# Altium schematic sheet 1.WIZ750SR_W7500P.SchDoc
size A4; DrawnBy: Peter; Organization: WIZnet Co., Ltd.; Address1: 5F, Humax Village; Address2: Hwangseaul-ro, Bundang-Gu; Address3: Seongnam-Si, Gyeonggi-Do; Address4: South Korea; Team: Wiki
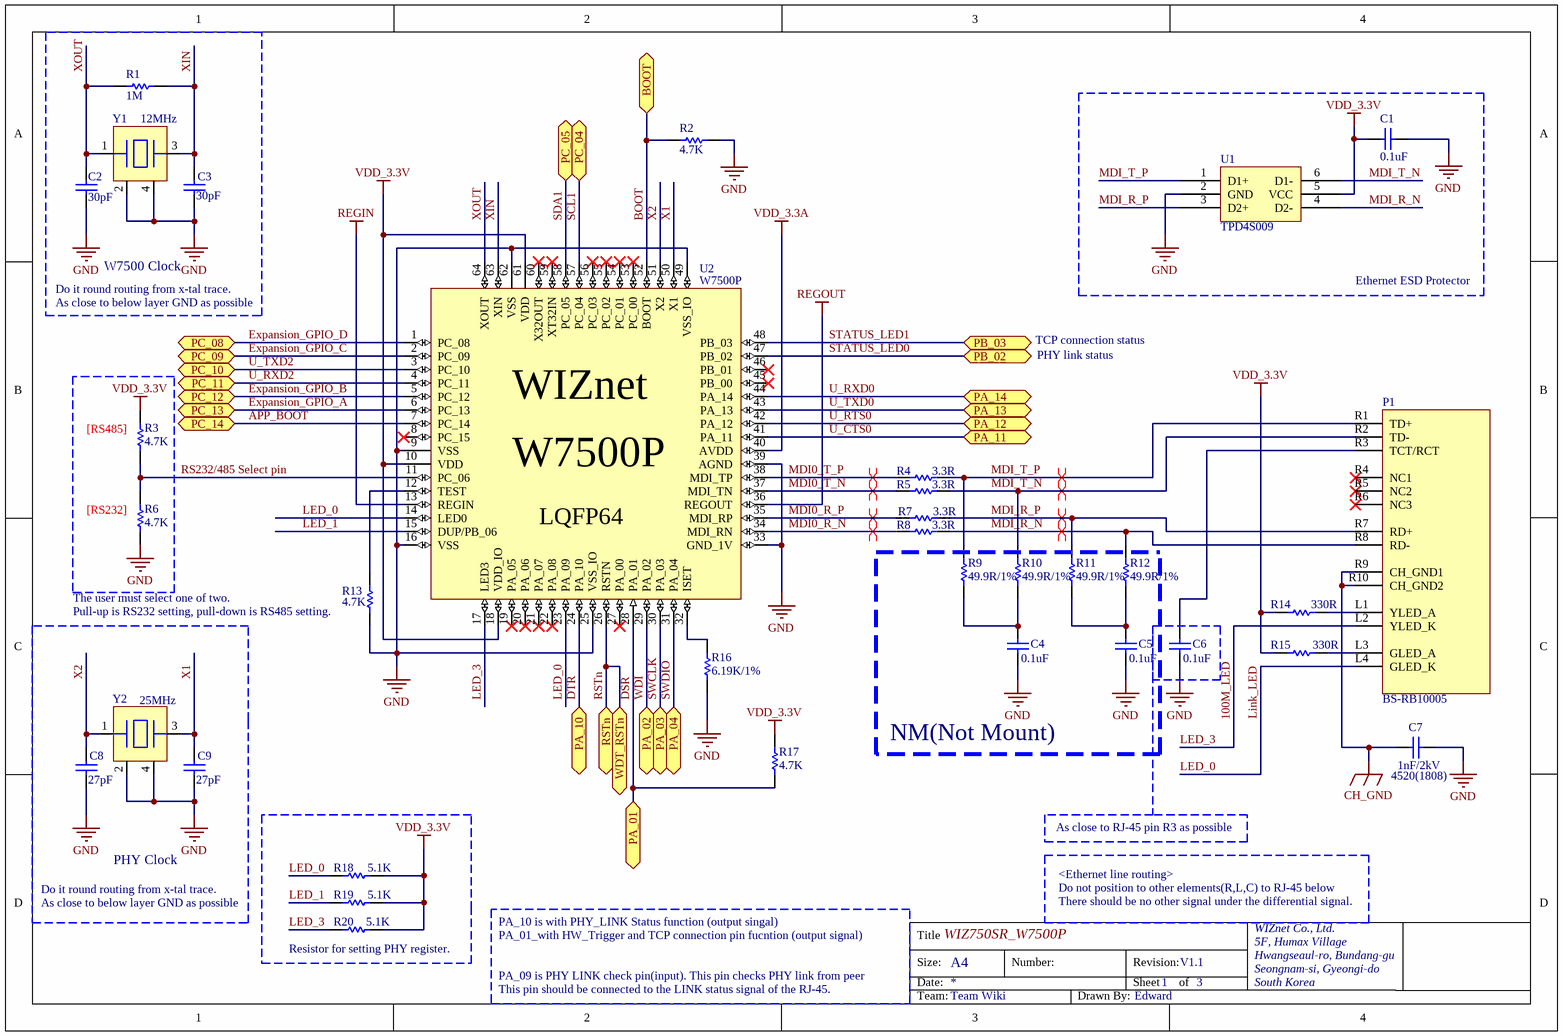
[diagram p0: 1.WIZ750SR_W7500P.SchDoc]

## Parts
C1  0.1uF  [CAP-0402]
C2  30pF  [CAP-0402]
C3  30pF  [CAP-0402]
C4  0.1uF  [CAP-0402]
C5  0.1uF  [CAP-0402]
C6  0.1uF  [CAP-0402]
C7  1nF/2kV  [CAP-1808]
C8  27pF  [CAP-0402]
C9  27pF  [CAP-0402]
P1  BS-RB10005  [RJ45-125BAG1A]
R1  1M  [RES-0402]
R2  4.7K  [RES-0402]
R3  4.7K  [RES-0402]
R4  3.3R  [RES-0402]
R5  3.3R  [RES-0402]
R6  4.7K  [RES-0402]
R7  3.3R  [RES-0402]
R8  3.3R  [RES-0402]
R9  49.9R/1%  [RES-0402]
R10  49.9R/1%  [RES-0402]
R11  49.9R/1%  [RES-0402]
R12  49.9R/1%  [RES-0402]
R13  4.7K  [RES-0402]
R14  330R  [RES-0402]
R15  330R  [RES-0402]
R16  6.19K/1%  [RES-0402]
R17  4.7K  [RES-0402]
R18  5.1K  [RES-0402]
R19  5.1K  [RES-0402]
R20  5.1K  [RES-0402]
U1  TPD4S009  [SOT-23-6L]
U2  W7500P  [W7500-LQFP64]
Y1  12MHz  [OSC-TZ1067B]
Y2  25MHz  [OSC-82J0626]

## Blocks framed on the sheet
W7500 Clock: C2 C3 R1 Y1
Ethernet ESD Protector: C1 U1
PHY Clock: C8 C9 Y2

## Ports
BOOT, PA_01, PA_02, PA_03, PA_04, PA_10, PA_11, PA_12, PA_13, PA_14, PB_02, PB_03, PC_04, PC_05, PC_08, PC_09, PC_10, PC_11, PC_12, PC_13, PC_14, RSTn, WDT_RSTn

## Nets
CH_GND: C7.2 P1.R9(CH_GND1) P1.R10(CH_GND2)
GND: C1.1 C2.1 C3.1 C4.1 C5.1 C6.1 C7.1 C8.1 C9.1 R2.1 R6.1 R13.1 R16.1 U1.2(GND) U2.9(VSS) U2.16(VSS) U2.25(VSS_IO) U2.33(GND_1V) U2.39(AGND) U2.49(VSS_IO) U2.62(VSS) Y1.2 Y1.4 Y2.2 Y2.4
REGIN: U2.13(REGIN)
REGOUT: U2.36(REGOUT)
VDD_3.3A: U2.40(AVDD)
VDD_3.3V: C1.2 R3.2 R14.1 R15.1 R17.1 R18.2 R19.2 R20.2 U1.5(VCC) U2.10(VDD) U2.18(VDD_IO) U2.61(VDD)
100M_LED: P1.L2(YLED_K) R20.1 U2.17(LED3)  [also labelled LED_3]
APP_BOOT: U2.7(PC_14) ; port PC_14
BOOT: R2.2 U2.52(BOOT) ; port BOOT
DSR: R17.2 U2.28(PA_01) ; port PA_01
DTR: U2.24(PA_10) ; port PA_10
Expansion_GPIO_A: U2.6(PC_13) ; port PC_13
Expansion_GPIO_B: U2.5(PC_12) ; port PC_12
Expansion_GPIO_C: U2.2(PC_09) ; port PC_09
Expansion_GPIO_D: U2.1(PC_08) ; port PC_08
LED_0: P1.L4(GLED_K) R18.1 U2.14(LED0) U2.23(PA_09)  [also labelled Link_LED]
LED_1: R19.1 U2.15(DUP/PB_06)
MDI0_R_N: R8.1 U2.34(MDI_RN)
MDI0_R_P: R7.1 U2.35(MDI_RP)
MDI0_T_N: R5.1 U2.37(MDI_TN)
MDI0_T_P: R4.1 U2.38(MDI_TP)
MDI_R_N: P1.R8(RD-) R8.2 R12.2 U1.4(D2-)
MDI_R_P: P1.R7(RD+) R7.2 R11.2 U1.3(D2+)
MDI_T_N: P1.R2(TD-) R5.2 R10.2 U1.6(D1-)
MDI_T_P: P1.R1(TD+) R4.2 R9.2 U1.1(D1+)
RS232/485 Select pin: R3.1 R6.2 U2.11(PC_06)
RSTn: U2.26(RSTN) ; port RSTn, port WDT_RSTn
SCL1: U2.57(PC_04) ; port PC_04
SDA1: U2.58(PC_05) ; port PC_05
STATUS_LED0: U2.47(PB_02) ; port PB_02
STATUS_LED1: U2.48(PB_03) ; port PB_03
SWCLK: U2.30(PA_03) ; port PA_03
SWDIO: U2.31(PA_04) ; port PA_04
U_CTS0: U2.41(PA_11) ; port PA_11
U_RTS0: U2.42(PA_12) ; port PA_12
U_RXD0: U2.44(PA_14) ; port PA_14
U_RXD2: U2.4(PC_11) ; port PC_11
U_TXD0: U2.43(PA_13) ; port PA_13
U_TXD2: U2.3(PC_10) ; port PC_10
WDI: U2.29(PA_02) ; port PA_02
X1: C9.2 U2.50(X1) Y2.3
X2: C8.2 U2.51(X2) Y2.1
XIN: C3.2 R1.2 U2.63(XIN) Y1.3
XOUT: C2.2 R1.1 U2.64(XOUT) Y1.1
NetC4_2: C4.2 R9.1 R10.1
NetC5_2: C5.2 R11.1 R12.1
NetC6_2: C6.2 P1.R3(TCT/RCT)
NetP1_L1: P1.L1(YLED_A) R14.2
NetP1_L3: P1.L3(GLED_A) R15.2
NetR13_2: R13.2 U2.12(TEST)
NetR16_2: R16.2 U2.32(ISET)

Not connected (* = marked no-connect by the designer): P1 R4(NC1)* R5(NC2)* R6(NC3)*; U2 8(PC_15)* 19(PA_05)* 20(PA_06)* 21(PA_07)* 22(PA_08)* 27(PA_00)* 45(PB_00)* 46(PB_01)* 53(PC_00)* 54(PC_01)* 55(PC_02)* 56(PC_03)* 59(XT32IN)* 60(X32OUT)*

## Layout directives
differential pair: MDI0_R_N, MDI0_R_P, MDI0_T_N, MDI0_T_P, MDI_R_N, MDI_R_P, MDI_T_N, MDI_T_P

## Notes on the sheet
- Do it round routing from x-tal trace.
- As close to below layer GND as possible
- TCP connection status
- PHY link status
- (near R3) [RS485]
- (near R6) [RS232]
- The user must select one of two.
- (near R13) Pull-up is RS232 setting, pull-down is RS485 setting.
- NM(Not Mount)
- (near C7) 4520(1808)
- As close to RJ-45 pin R3 as possible
- PA_10 is with PHY_LINK Status function (output singal)
- <Ethernet line routing>
- Do not position to other elements(R,L,C) to RJ-45 below
- There should be no other signal under the differential signal.
- (near R20) Resistor for setting PHY register.
- PA_09 is PHY LINK check pin(input). This pin checks PHY link from peer
- PA_01_with HW_Trigger and TCP connection pin fucntion (output signal)
- Title
- Size:
- Date:
- WIZ750SR_W7500P
- A4
- Number:
- Revision:
- Sheet
- 1
- of
- V1.1
- 3
- WIZnet Co., Ltd.
- 5F, Humax Village
- Hwangseaul-ro, Bundang-gu
- Seongnam-si, Gyeongi-do
- South Korea
- This pin should be connected to the LINK status signal of the RJ-45.
- Team:
- Team Wiki
- Drawn By:
- Edward
- (in symbol W7500P) WIZnet; LQFP64

## Library data of the parts
C1-C6 C8 C9 = CAP-0402: Ceramic CAP 0402(1005)
C7 = CAP-1808: Ceramic CAP 1808(4520)
P1 = RB1-125BAG1A: 10/100 BASE-TX MAGJACK
R1-R20 = RES-0402
U1 = tpd4s009: 6-PIN SOT DBVor DCK Package
U2 = W7500P: WIZnet ARM Cortex-M0, Add PHY
Y1 = OSC-TZ1067B-12MHz: X-tal 12MHz,3.2x2.5 SMD, CL=20pF
Y2 = OSC-82J0626-25MHz: X-tal 25MHz,3.2x2.5 SMD, CL=18pF